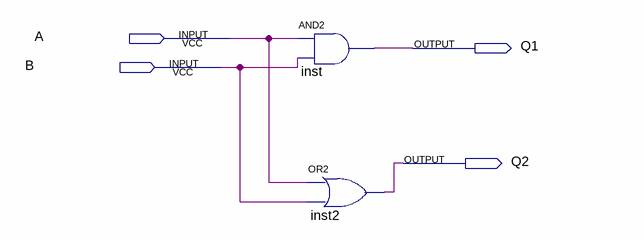
[diagram p0: schematic sheet]
// Quartus schematic Practica_02.bdf as structural Verilog: 2 symbols, 4 pins
module Practica_02 (
  input  A,
  input  B,
  output Q1,
  output Q2
);

  and inst (Q1, A, B);
  or inst2 (Q2, A, B);
endmodule
